# EAGLE schematic schematic_wdriver (EAGLE 9.6.2)
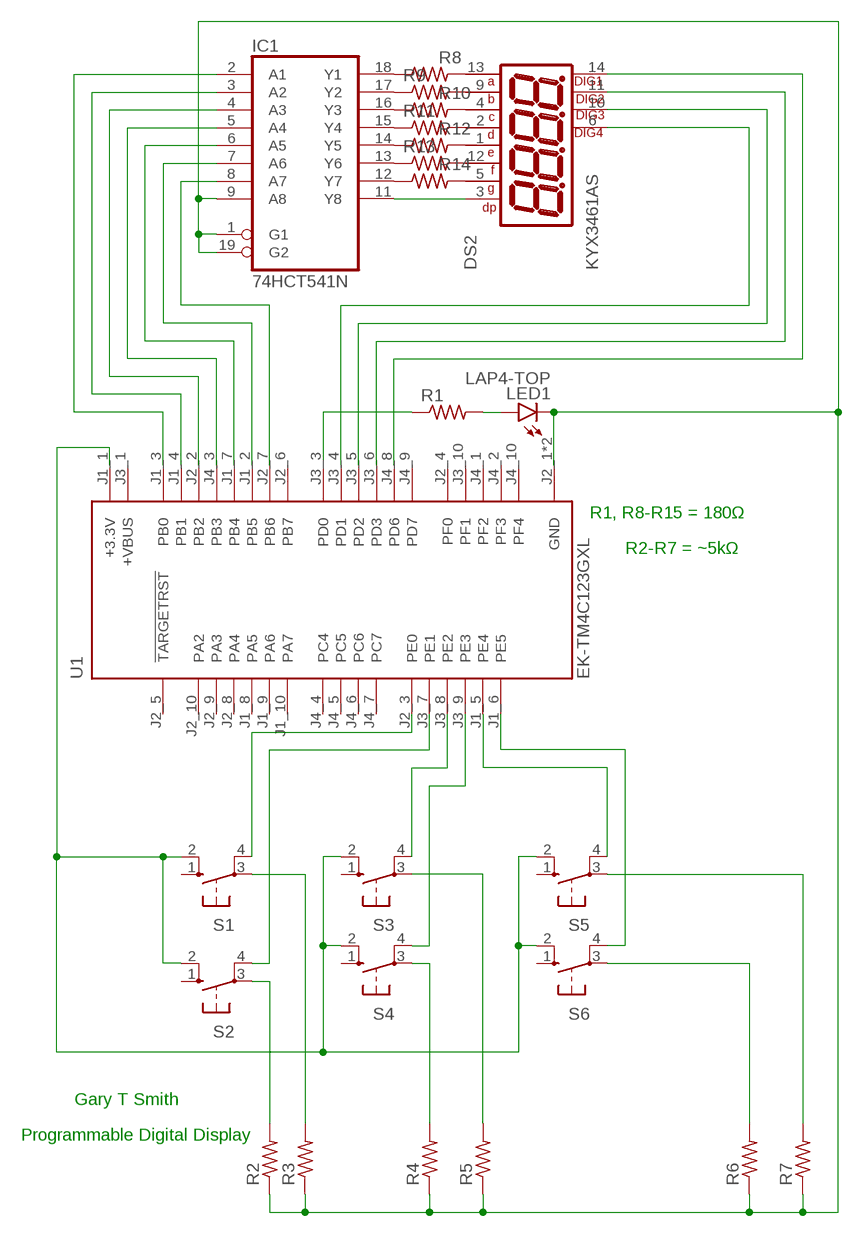
[diagram p0: schematic, sheet 1]

## Parts
DS2  KYX3461AS  [DISPLAY_KYX3461AS]
IC1  74HCT541N  [DIL20]
LED1  LAP4-TOP  [P47F-TOP]
R1  R-US_0204/2V  [0204V]
R2  R-US_0204/2V  [0204V]
R3  R-US_0204/2V  [0204V]
R4  R-US_0204/2V  [0204V]
R5  R-US_0204/2V  [0204V]
R6  R-US_0204/2V  [0204V]
R7  R-US_0204/2V  [0204V]
R8  R-US_0204/2V  [0204V]
R9  R-US_0204/2V  [0204V]
R10  R-US_0204/2V  [0204V]
R11  R-US_0204/2V  [0204V]
R12  R-US_0204/2V  [0204V]
R13  R-US_0204/2V  [0204V]
R14  R-US_0204/2V  [0204V]
S1  10-XX  [B3F-10XX]
S2  10-XX  [B3F-10XX]
S3  10-XX  [B3F-10XX]
S4  10-XX  [B3F-10XX]
S5  10-XX  [B3F-10XX]
S6  10-XX  [B3F-10XX]
U1  EK-TM4C123GXL  [MODULE_EK-TM4C123GXL]

## Nets
N$1: IC1.18(Y1) R8.1
N$2: R1.1 U1.J3_3(PD0)
N$3: IC1.8(A7) U1.J2_7(PB6)
N$4: IC1.13(Y6) R13.1
N$5: IC1.6(A5) U1.J1_7(PB4)
N$6: IC1.5(A4) U1.J4_3(PB3)
N$7: IC1.4(A3) U1.J2_2(PB2)
N$8: IC1.3(A2) U1.J1_4(PB1)
N$9: DS2.12(F) R13.2 R14.1
N$10: DS2.6(DIG4) U1.J3_4(PD1)
N$11: DS2.10(DIG3) U1.J3_5(PD2)
N$12: DS2.11(DIG2) U1.J3_6(PD3)
N$13: DS2.14(DIG1) U1.J4_8(PD6)
N$14: LED1.A R1.2
N$15: DS2.5(G) IC1.12(Y7) R14.2
N$16: S6.4(P1) U1.J1_6(PE5)
N$17: S1.2(S1) S2.2(S1) S3.2(S1) S4.2(S1) S5.2(S1) S6.2(S1) U1.J1_1(+3.3V)
N$18: S5.4(P1) U1.J1_5(PE4)
N$19: S1.4(P1) U1.J2_3(PE0)
N$20: S2.4(P1) U1.J3_7(PE1)
N$21: S3.4(P1) U1.J3_8(PE2)
N$22: S4.4(P1) U1.J3_9(PE3)
N$23: DS2.1(E) IC1.14(Y5) R12.1 R12.2
N$24: R6.2 S6.3(P)
N$25: R7.2 S5.3(P)
N$26: R3.2 S1.3(P)
N$27: R2.2 S2.3(P)
N$28: R4.2 S4.3(P)
N$29: R5.2 S3.3(P)
N$30: IC1.2(A1) U1.J1_3(PB0)
N$31: DS2.13(A) R8.2
N$32: DS2.3(DP) IC1.11(Y8)
N$34: DS2.2(D) IC1.15(Y4) R11.1 R11.2
N$35: IC1.7(A6) U1.J1_2(PB5)
N$36: DS2.4(C) IC1.16(Y3) R10.1 R10.2
N$37: DS2.9(B) IC1.17(Y2) R9.1 R9.2
N$43: IC1.1(G1) IC1.9(A8) IC1.19(G2) LED1.C R2.1 R3.1 R4.1 R5.1 R6.1 R7.1 U1.J2_1(GND) U1.J3_2(GND)
Unconnected: S1.1(S) S2.1(S) S3.1(S) S4.1(S) S5.1(S) S6.1(S) U1.J1_8(PA5) U1.J1_9(PA6) U1.J1_10(PA7) U1.J2_4(PF0) U1.J2_5(!TARGETRST) U1.J2_6(PB7) U1.J2_8(PA4) U1.J2_9(PA3) U1.J2_10(PA2) U1.J3_10(PF1) U1.J4_1(PF2) U1.J4_2(PF3) U1.J4_4(PC4) U1.J4_5(PC5) U1.J4_6(PC6) U1.J4_7(PC7) U1.J4_9(PD7) U1.J4_10(PF4)

## Notes on the sheet
- R1, R8-R15 = 180Ω
- R2-R7 = ~5kΩ
- Gary T Smith
- Programmable Digital Display

## Power pins joined to a net without a drawn wire
+VBUS: U1.J3_1(+VBUS)
GND: IC1.10(GND)
VCC: IC1.20(VCC)

## Library data of the parts
DS2 = KYX3461AS:KYX3461AS: 0.36 inch 5 digits red 7 segments led display; AVAILABILITY: Unavailable; DESCRIPTION: 0.36 inch 5 digits red 7 segments led display; MF: KYX; MP: KYX3561AS; PACKAGE: Package; PRICE: None
IC1 = 74xx-eu:74*541: Octal BUFFER and LINE DRIVER, 3-state
LED1 = led:*P4: PointLED® Enhanced Thinfilm LED TOP & BOTTOM mount LS P47F, LR P47F, LA P47F, LY P47F, LT P4SG, LB P4SG, LW P4SG Source: http://catalog.osram-os.com .. LA_LR_LS_LY_P47F_Pb_free.pdf
R1-R14 = rcl:R-US_: RESISTOR, American symbol; SPICEPREFIX: R
S1-S6 = switch-omron:10-XX: OMRON SWITCH; MPN: B3F-1000; OC_FARNELL: 176432; OC_NEWARK: 36M3542
U1 = EK-TM4C123GXL:EK-TM4C123GXL: ARM® Cortex®-M4F Based MCU TM4C123G LaunchPad™ Evaluation Kit Check prices <https://pricing.snapeda.com/parts/EK-TM4C123GXL/Texas%20Instruments/view-part?ref=eda>; AVAILABILITY: Warning; DESCRIPTION: ARM® Cortex®-M4F Based MCU TM4C123G LaunchPad™ Evaluation Kit; MF: Texas Instruments; MP: EK-TM4C123GXL; PACKAGE: None; PRICE: None; PURCHASE-URL: https://pricing.snapeda.com/search/part/EK-TM4C123GXL/?ref=eda